# Altium schematic sheet Buck converter_5V.SchDoc
size A; SheetNumber: 3; SheetTotal: 3
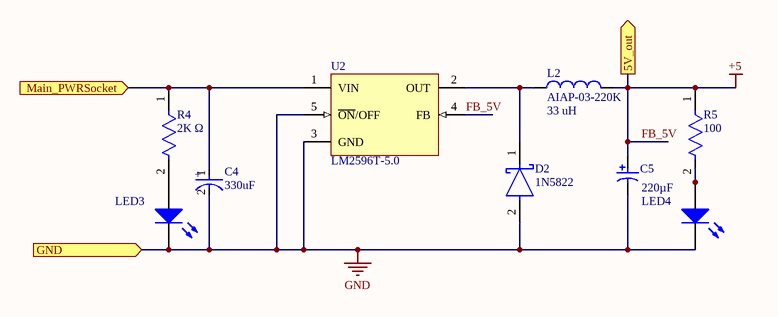
[diagram p0: Buck converter_5V.SchDoc]

## Parts
C4  value 330uF  [FP-EEU-FC1V221L-MFG]  (hidden comment: 16SVP180MX)
C5  Capacitance: 220µF  [PNSC-EEUFM1H221-2]  (hidden comment: EEU-FM1H221)
D2  1N5822  [FP-DO-201AD-MFG]
L2  AIAP-03-220K  Inductance: 33 uH  [ABRA-AIAP-02-2_V2]
LED3  (no value)  [Type 5mm]
LED4  (no value)  [Type 5mm]
R4  value 2K Ω  [FP-MFR-25-MFG]  (hidden comment: MFR-25FBF52-1K18)
R5  value 100  [FP-MFR-25-MFG]  (hidden comment: MFR-25FBF52-1K18)
U2  LM2596T-5.0  [NDH0005A]

## Ports
5V_out (out), GND (in), Main_PWRSocket (in)

## Nets
FB_5V: C5.1 L2.2 R5.1 U2.4(FB) ; port 5V_out  [also labelled +5]
GND: C4.2(A) C5.2 D2.2(A) LED3.1(K) LED4.1(K) U2.3(GND) U2.5(~{ON}/OFF) ; port GND
Main_PWRSocket: C4.1(C) R4.1 U2.1(VIN) ; port Main_PWRSocket
NetD2_1: D2.1(C) L2.1 U2.2(OUT)
NetLED3_2: LED3.2(A) R4.2
NetLED4_2: LED4.2(A) R5.2

## Notes on the sheet
- (in symbol CMP-05427-000010-1) +

## Library data of the parts
C4 = CMP-05427-000010-1: CAP ALUM 220UF 20% 35V RADIAL; Manufacturer: Panasonic Electronic Components; Manufacturer Part Number: EEU-FC1V221L; Material: Aluminum; Leakage Current: 77uA; Esr: 0.085Ω; Life: 2000Hours; Automotive Grade: Grade 2; Dissipation Factor: 12%; Ripple Current: 730mA; Octopart: https://octopart.com/eeu-fc1v221l-panasonic-39478519; ComponentLink2URL: https://industrial.panasonic.com/cdbs/www-data/pdf/RDF0000/ABA0000C1209.pdf; Package: 0; Height: 16.5mm; Category: Cap; ComponentLink2Description: Datasheet; Lead Free: Yes; Device Class L2: Capacitors; Temperature Range High: +105°C; Mouser Description: Capacitor; Aluminum Electrolytic; Fc Radial Elec Cap 220uF 35V; Temperature: -55°C to +105°C; Digikey Description: CAP ALUM 220UF 20% 35V RADIAL; Device Class L3: Aluminum Electrolytic Capacitors; Device Class L1: Passive Components; Automotive: Yes; RoHS: TRUE; Temperature Range Low: -55°C; Capacitance: 330uF; Voltage Rating: 35V; Tolerance: 20%
C5 = CMP-2000-05312-1: Radial Lead Aluminum Electrolytic Capacitor, 220 uF, +/- 20%, 50 V, -40 to 105 degC, RoHS, Bulk; Manufacturer: Panasonic; Rated Voltage: 50V; Impedance: 0.03O; Ripple Current: 1650mA; Lifetime@Temperature: 4000Hrs@105degC; Datasheet Version: May-14; Manufacturer URL: http://www.panasonic.com/; Operating Temp Range: -40to+105degC; Datasheet URL: https://datasheet.ciiva.com/11779/0900766b805f3abe-11779695.pdf; Operating Temp-Max: 105degC; Series: FM; Type: Radial; Case Size/Dimension: Ø10x16mm
D2 = CMP-12187-000025-1: DIODE SCHOTTKY 40V 3A DO201AD; Manufacturer: STMicroelectronics; Max Junction Temp: +150°C; Peak Reverse Current: 2mA; Max Surge Forward Current: 80A; Temperature Range High: +150°C; Automotive: No; RoHS: TRUE; ComponentLink2Description: Datasheet; Manufacturer Part Number: 1N5822; Lead Free: Yes; Octopart: https://octopart.com/1n5822-stmicroelectronics-323225; Device Class L2: Diodes; Max Repetitive Reverse Voltage: 40V; Temperature: to +150°C; Height: 5.3mm; Category: Diode; Digikey Description: DIODE SCHOTTKY 40V 3A DO201AD; ComponentLink2URL: https://www.st.com/resource/en/datasheet/1n5822.pdf; Device Class L3: Schottky Diodes; Device Class L1: Discrete Semiconductors; Forward Current: 3A; Mouser Description: Schottky Diodes & Rectifiers Vr/40V Io/3A BULK; Package: DO-201AD
L2 = CMP-0740-00001-1: Axial Power Inductor, 1000 uH +/- 10%, 0.4 A Max, 2.3 Ohm Max, -40 to 85 degC, 6.4 mm Dia x 14 mm Length, RoHS, Bag; PartNumber: AIAP-02-102K; Manufacturer: Abracon; DCR Max: 2.3 Ohm; IDC Max: 0.4 A; Tolerance: +/- 10%; ComponentLink2Description: Datasheet; ComponentLink3Description: Package Specification; RoHS: TRUE; Operating Temperature: -40 to 85 degC; ComponentLink1Description: Manufacturer URL; PackageVersion: Rev. 02.12.12; PackageReference: AIAP-02-2; ComponentLink1URL: http://www.abracon.com/; DatasheetVersion: 2/12/2012; ComponentLink2URL: http://www.abracon.com/Magnetics/axial/AIAP-02.pdf; Packing: Bag; PackageDescription: 2-Pin Axial Leaded, Dia 6.4 mm, Length 14 mm; Mounting Technology: Through Hole; ComponentLink3URL: http://www.abracon.com/Magnetics/axial/AIAP-02.pdf
LED3 LED4 = CMP-1488-00007-1: THT LED round mono-color color lens, WL-TMRW, Bright Green; PartNumber: 151051VS04000; Manufacturer: Wuerth Elektronik; Emitting color: Bright Green; ComponentLink1Description: Manufacturer URL; PackageReference: Type 5mm; ComponentLink2URL: http://katalog.we-online.de/pbs/datasheet/7448042001.pdfhttp://katalog.we-online.de/pbs/datasheet/7448042001.pdfhttp://katalog.we-online.de/pbs/datasheet/7448042001.pdfhttp://katalog.we-online.de/pbs/datasheet/151051VS04000.pdf; ComponentLink1URL: http://www.we-online.com; ComponentLink2Description: Datasheet
R4 R5 = CMP-03413-000001-1: RES 1.18K OHM 1/4W 1% AXIAL; Manufacturer: Yageo; Temperature Coefficient: 100ppm/°C; Power Rating: 0.25W; Voltage Rating: 250V; Resistance: 10K Ω; Temperature: -55°C to +155°C; Automotive: No; Temperature Range High: +155°C; Mouser Description: Metal Film Resistors 1.18K OHM 1/4W 1%; Digikey Description: RES 1.18K OHM 1/4W 1% AXIAL; Lead Free: Yes; Tolerance: 1%; ComponentLink2Description: Datasheet; ComponentLink2URL: https://www.yageo.com/upload/media/product/products/datasheet/lr/Yageo_LR_MFR_1.pdf; Temperature Range Low: -55°C; Package: MFR-25; Ipc Land Pattern Name: RESAD1000W75L680D260; Composition: Metal Film; Category: Res; Octopart: https://octopart.com/mfr-25fbf52-1k18-yageo-56251681; Series: MFR; Device Class L2: Resistors; Height: 2.6mm; Device Class L3: Through-Hole Resistors; Manufacturer Part Number: MFR-25FBF52-1K18; RoHS: TRUE; Device Class L1: Passive Components
U2 = CMP-0069-01931-3: SIMPLE SWITCHER® Power Converter 150 KHz 3A Step-Down Voltage Regulator, 5-pin TO-220; Manufacturer: Texas Instruments; PackageTopMarking: NSUZXYTTE#*LM2596T*-5.0 P+; PowerWise: N; RoHS: N; ComponentLink1URL: http://www.ti.com/general/docs/lit/getliterature.tsp?genericPartNumber=LM2596&fileType=pdf; PackageReference: NDH0005A; CompType: Switcher; ComponentLink1Description: Datasheet URL; PackageDescription: TO-220, Molded, Stagger Bend, 5 Lead; PinCount: 5